# Altium project 01-LcdText1602.PrjPcb
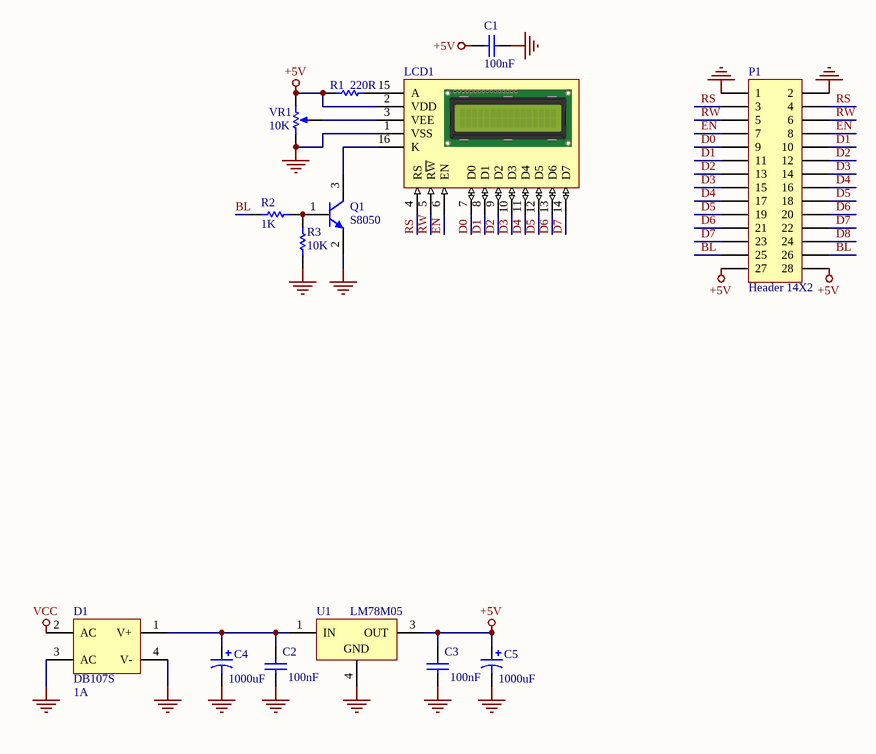
[diagram p0: 01-LcdText1602.SchDoc]
1 sheet, 14 parts. Net scope: global (net labels, ports and power ports of the same name join across sheets).

## Sheet 01-LcdText1602.SchDoc
size A4

### Parts
C1  value 100nF  [RAD-0.3]  (hidden comment: 104)
C2  value 100nF  [RAD-0.3]  (hidden comment: 104)
C3  value 100nF  [RAD-0.3]  (hidden comment: 104)
C4  value 1000uF  [RB7.6-15]  (hidden comment: 1000uF/16V)
C5  value 1000uF  [RB7.6-15]  (hidden comment: 1000uF/16V)
D1  DB107S  value 1A  [D-46_6A]
LCD1  16 x 2  [LCD16x2]  (value not drawn)
P1  Header 14X2  [HDR2X14]
Q1  S8050  [TO-226-AA]
R1  220R  [AXIAL-0.3]
R2  1K  [AXIAL-0.3]
R3  10K  [AXIAL-0.3]
U1  value LM78M05  [NDP0003B_M]  (hidden comment: LM78M05CDTX)
VR1  10K  [VR5]

### Nets
+5V: C1.1 C3.1 C5.1 LCD1.2(VDD) P1.27 P1.28 R1.1 U1.3(OUT) VR1.3(BOT)
GND: C1.2 C2.2 C3.2 C4.2 C5.2 D1.3(AC) D1.4(V-) LCD1.1(VSS) P1.1 P1.2 Q1.2(E) R3.1 U1.4(GND) VR1.1(TOP)
VCC: D1.2(AC)
BL: P1.25 P1.26 R2.2
D0: LCD1.7(D0) P1.9
D1: LCD1.8(D1) P1.10 P1.11
D2: LCD1.9(D2) P1.12 P1.13
D3: LCD1.10(D3) P1.14 P1.15
D4: LCD1.11(D4) P1.16 P1.17
D5: LCD1.12(D5) P1.18 P1.19
D6: LCD1.13(D6) P1.20 P1.21
D7: LCD1.14(D7) P1.22 P1.23
D8: P1.24
EN: LCD1.6(EN) P1.7 P1.8
RS: LCD1.4(RS) P1.3 P1.4
RW: LCD1.5(R~{W}) P1.5 P1.6
NetC2_1: C2.1 C4.1 D1.1(V+) U1.1(IN)
NetLCD1_3: LCD1.3(VEE) VR1.2(TAP)
NetLCD1_15: LCD1.15(A) R1.2
NetLCD1_16: LCD1.16(K) Q1.3(C)
NetQ1_1: Q1.1(B) R2.1 R3.2

### Library data of the parts
C1-C3 = Cap: Capacitor; Published: 8-Jun-2000; LatestRevisionDate: 17-Jul-2002; LatestRevisionNote: Re-released for DXP Platform.; PackageReference: RAD-0.3; Publisher: Altium Limited; PackageDescription: Radial Cap, Thru-Hole; 2 Leads; 0.3 in Pin Spacing
C4 C5 = Cap Pol1: Polarized Capacitor (Radial); Published: 8-Jun-2000; LatestRevisionDate: 17-Jul-2002; LatestRevisionNote: Re-released for DXP Platform.; PackageReference: RB7.6-15; Publisher: Altium Limited; PackageDescription: Polarized Capacitor (Radial); 2 Leads
D1 = Bridge2: Diode Bridge; Published: 24-Mar-1999; LatestRevisionDate: 17-Jul-2002; LatestRevisionNote: Re-released for DXP Platform.; PackageReference: D-46_6A; PackageDescription: Bridge Rectifier; 4 Terminals; Body 16.8 x 16.8 mm (typ); Pitch 10.67 mm
LCD1 = LCD16X2: Liquid Crystal Display; Value: LCD 16x2
P1 = Header 14X2: Header, 14-Pin, Dual row; LatestRevisionDate: 17-Jul-2002; LatestRevisionNote: Re-released for DXP Platform.; Publisher: Altium Limited
Q1 = NPN: NPN Bipolar Transistor; Published: 8-Jun-2000; LatestRevisionDate: 17-Jul-2002; LatestRevisionNote: Re-released for DXP Platform.; PackageReference: TO-226-AA; Value: S8050; PackageDescription: TO, Flat Index; 3 In-Line, Axial Leads; Body Dia. 4.8mm; Leads 0.55 x 0.51 mm (max); Code_JEDEC: TO-226-AA
R1-R3 = Res1: Resistor; Published: 8-Jun-2000; LatestRevisionDate: 17-Jul-2002; LatestRevisionNote: Re-released for DXP Platform.; PackageReference: AXIAL-0.3; Publisher: Altium Limited; PackageDescription: Axial Device, Thru-Hole; 2 Leads; 0.3 in Pin Spacing
  R1: Value: 220R
  R2: Value: 1K
  R3: Value: 10K
U1 = CMP-0062-00204-3: 3-Terminal Positive Voltage Regulators, 3-pin TO-252; Manufacturer: Texas Instruments; PackageTopMarking: NSUZXYTT*LM78M05*CDT; PowerWise: N; CompType: LDO IC; ComponentLink1Description: Datasheet URL; ComponentLink1URL: http://www.ti.com/general/docs/lit/getliterature.tsp?genericPartNumber=LM78M05&fileType=pdf; PackageReference: NDP0003B; Code_JEDEC: TO-252-AA; PinCount: 3; PackageDescription: TO252, Molded, Jedec, 6.8 x 6.10 x 2.30mm Body, 3 Lead, 2.28mm Pitch, Surface Mount
VR1 = RPot: Potentiometer; Sim Note: Enter the Resistance value and the set point into parameter fields.; Set Position: 0.5; Published: 8-Jun-2000; LatestRevisionDate: 17-Jul-2002; LatestRevisionNote: Re-released for DXP Platform.; PackageReference: VR5; Publisher: Altium Limited; Value: 10K